# EasyEDA Pro project USB接收端.epro

# Schematic USB接收端
Board Name: USB接收端; Create Date: 2025-04-09; Page Name: P1; Project Name: 空中鼠标; Schematic Name: USB接收端; Update Date: 2025-04-11; Company: 嘉立创EDA; Page Size: A4; Version: V1.0
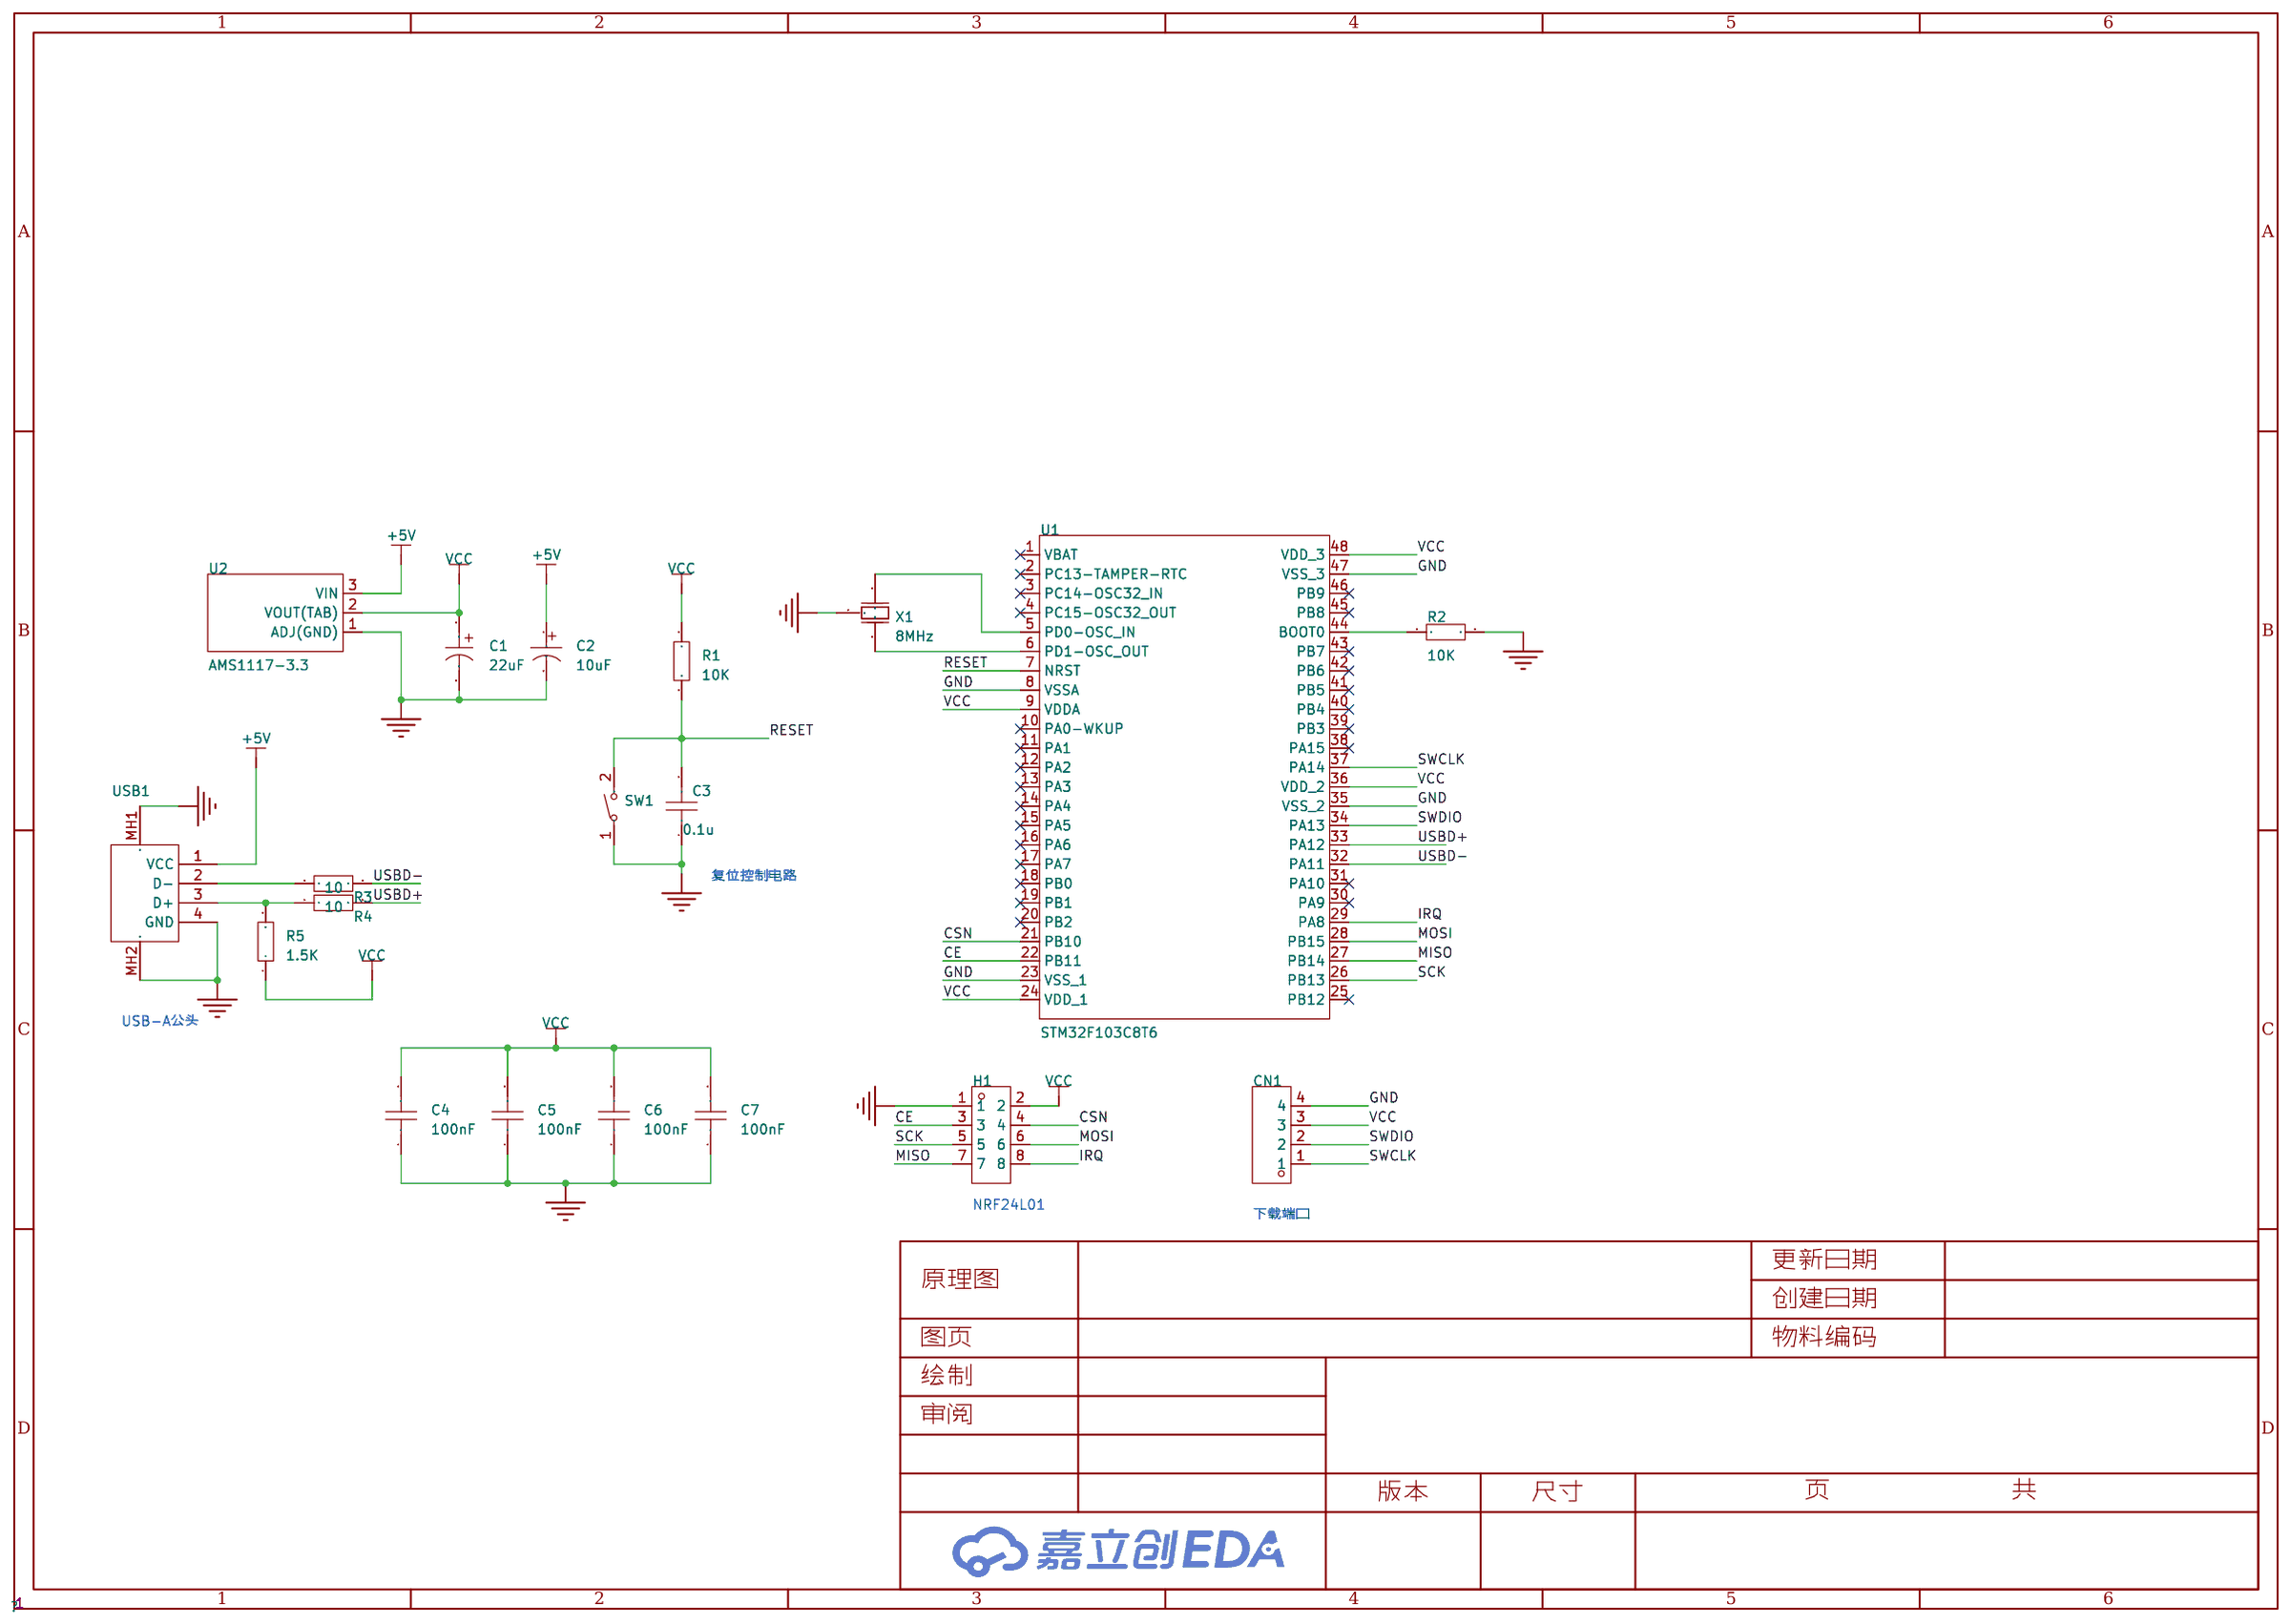
[diagram p0: schematic sheet]

## Parts
C1  22uF  [CAP-SMD_BD5.0-L5.3-W5.3-LS6.0-FD]
C2  10uF  [CAP-SMD_BD4.0-L4.3-W4.3-FD]
C3  0.1u  [C0603]
C4  100nF  [C0603]
C5  100nF  [C0603]
C6  100nF  [C0603]
C7  100nF  [C0603]
CN1  HC-ZH1.5-4AW  [CONN-TH_4P-P1.50_HCTL_HC-ZH1.5-4AW]
H1  PM254V-12-08-H85  [HDR-TH_8P-P2.54-V-F-R2-C4-S2.54]
R1  10K  [R0603]
R2  10K  [R0603]
R3  10  [R0603]
R4  10  [R0603]
R5  1.5K  [R0603]
SW1  GT-TC060A-H025-L1S  [SW-SMD_L6.1-W3.5-LS8.0]
U1  STM32F103C8T6  [LQFP-48_L7.0-W7.0-P0.50-LS9.0-BL]
U2  AMS1117-3.3  [SOT-89_L4.5-W2.5-P1.50-LS4.2-BR]
USB1  AM90  [USB-AM-TH_AM90]
X1  8MHz  [OSC-SMD_3P-L3.2-W1.3-P1.2-L]

## Library data of the parts
C1 = CS1E220M-CRD54_C3001207: 容值:22uF;精度:±20%;额定电压:25V;纹波电流:25mA@120Hz;; LCSC Part Name: 22uF ±20% 25V; Supplier Part: C3001207; Manufacturer: ROQANG(容强); Manufacturer Part: CS1E220M-CRD54; Supplier Footprint: SMD,D5xL5.4mm; JLCPCB Part Class: 扩展库; Datasheet: https://atta.szlcsc.com/upload/public/pdf/source/20220429/2E3FD7691B47DB548ED5C60C43423355.pdf; Supplier: LCSC; Tolerance: ±20%; Voltage Rating: 25V; Ripple Current: 25mA@120Hz; Diameter: 5mm; Height - Seated (Max): 5.4mm; Lifetime: 2000hrs@105℃; Operating Temperature: -40℃~+105℃
C2 = RVT1V100M0405_C72485: 容值:10uF;精度:±20%;额定电压:35V;纹波电流:15mA@120Hz;等效串联电阻(ESR):-;; LCSC Part Name: 10uF ±20% 35V; Supplier Part: C72485; Manufacturer: ROQANG(容强); Manufacturer Part: RVT1V100M0405; Supplier Footprint: SMD,D4xL5.4mm; JLCPCB Part Class: 扩展库; Datasheet: https://atta.szlcsc.com/upload/public/pdf/source/20170325/1490427950282.pdf; Supplier: LCSC; Tolerance: ±20%; Voltage Rating: 35V; Ripple Current: 15mA@120Hz; Diameter: 4mm; Height - Seated (Max): 5.4mm; Lifetime: 2000hrs@105℃; Operating Temperature: -40℃~+105℃
C3-C7 = CAP_0603: Supplier Footprint: 0603
CN1 = HC-ZH1.5-4AW: 插针结构:1x4P;间距:1.5mm;安装方式:弯插;参考系列:ZH;总PIN数:4P;排数:1;每排PIN数:4;行距:-;额定电流:1A;触头材质:黄铜;触头镀层:锡;工作温度范围:-25℃~+85℃;; LCSC Part Name: 1x4P 间距:1.5mm 弯插 系列:ZH; Supplier Part: C2845567; Manufacturer: HCTL(华灿天禄); Supplier Footprint: 弯插,P=1.5mm; JLCPCB Part Class: 扩展库; Datasheet: https://atta.szlcsc.com/upload/public/pdf/source/20230711/CEA84C90BC30863458C9BDB0466F53F6.pdf; Supplier: LCSC; Pins Structure: 1x4P; Pitch: 1.5mm; Mounting Style: 弯插; Reference Series: ZH; Number of Pins: 4P; Number of Rows: 1; Number of PINs Per Row: 4; Current Rating (Max): 1A; Contact Material: 黄铜; Contact Plating: 锡; Operating Temperature Range: -25℃~+85℃; Rated Voltage (Max): 100V; Plastic Material: PBT; Flame Retardant Rating: UL94V-0; Supplementary Features: 打K脚; Z-Height of the Board: 3.7mm; X-Length of Bottom Edge on Board (Spacing Line): 7.5mm
H1 = PM254V-12-08-H85: 插孔结构:2x4P;间距:2.54mm;行距:2.54mm;圆孔/方孔:方孔;安装类型:直插;排数:双排;总孔位数:8P;额定电流:3A;额定电压:250V;插孔方向:顶部;塑高:8.5mm;工作温度范围:-40℃~+105℃;; LCSC Part Name: 间距:2.54mm 2x4P 直插; Supplier Part: C2834799; Manufacturer: XFCN(兴飞); Supplier Footprint: 插件,P=2.54mm; JLCPCB Part Class: 扩展库; Datasheet: https://atta.szlcsc.com/upload/public/pdf/source/20200309/C492399_8C441E2934FBB604A89B37A68AA45ECF.pdf; Supplier: LCSC; Holes Structure: 2x4P; Pitch: 2.54mm; Row Spacing: 2.54mm; Circular Hole / Square Hole: 方孔; Mounting Type: 直插; Number of Rows: 双排; Number of Holes: 8P; Current Rating (Max): 3A; Voltage Rating (Max): 250V; Holes Direction: 顶部; Insulation Height: 8.5mm; Operating Temperature Range: -40℃~+105℃
R1-R5 = Res_0603: Supplier Footprint: 0603
SW1 = GT-TC060A-H025-L1S: 电路结构:单刀单掷;作用力:1.6N;安装方式:立贴;带支架:不带;触点电流:50mA;额定电压(AC):12V;额定电压(DC):12V;绝缘电阻:100MΩ;带灯:无;机械寿命:10万次;; LCSC Part Name: 3×6×2.5 立贴 无声轻触开关; Supplier Part: C7450623; Manufacturer: G-Switch(品赞); Supplier Footprint: SMD,3x6mm; JLCPCB Part Class: 扩展库; Datasheet: https://atta.szlcsc.com/upload/public/pdf/source/20230712/3FF422A4BEDB42853830040444FDF292.pdf; Supplier: LCSC; Circuit: 单刀单掷; Operating Force: 1.6N; Mounting Style: 立贴; Strike Gundam: 不带; Contact Current: 50mA; Voltage Rating (AC): 12V; Voltage Rating (DC): 12V; Insulation Resistance: 100MΩ; With Lamp: 无; Mechanical Life: 10万次
U1 = STM32F103C8T6: CPU内核:ARM-M3;CPU最大主频:72MHz;应用领域:-;; LCSC Part Name: 主流增强型ARM Cortex-M3 MCU，具有64 KB Flash、72 MHz CPU、电机控制、USB和CAN; Supplier Part: C8734; Manufacturer: ST(意法半导体); Supplier Footprint: LQFP-48(7x7); JLCPCB Part Class: 扩展库; Datasheet: https://atta.szlcsc.com/upload/public/pdf/source/20220812/8363ACEC51AD55ECEB84799464F7CB85.pdf; Supplier: LCSC; CPU Core: ARM-M3; CPU Maximum Speed: 72MHz; Program Storage Size: 64KB; Program Memory Type: FLASH; Number of I/O: 37; ADC (Bit): 12bit; Low Voltage Detection Threshold: 2V~3.6V
U2 = AMS1117-3.3_C347256: 输出类型:固定;工作电压:18V;输出电压:3.3V;输出电流:1A;电源纹波抑制比(PSRR):60dB@(120Hz);输出极性:正极;; LCSC Part Name: 输出:3.3V 电流:1A 耐压:18V; Supplier Part: C347256; Manufacturer: UMW(友台半导体); Supplier Footprint: SOT-89; JLCPCB Part Class: 扩展库; Datasheet: https://atta.szlcsc.com/upload/public/pdf/source/20241218/BAF0263FA2E44BCD8AF41AA4FA04EFAA.pdf; Supplier: LCSC; Output Type: 固定; Voltage - Supply: 18V; Output Voltage: 3.3V; Output Current: 1A; Power Supply Rejection Ratio (PSRR): 60dB@(120Hz); Voltage Dropout: 1.3V@(1A); Features: 过流保护; Output Configuration: 正极; Number of Outputs: 1
USB1 = AM90: 连接器类型:Type-A;标准:USB 2.0;公母:公;安装方式:弯插;触点数量:4P;端口数量:1;额定电流 - 电源:1.5A;工作温度范围:-25℃~+85℃;; LCSC Part Name: Type-A 公 弯插; Supplier Part: C404965; Manufacturer: SHOU HAN(首韩); Supplier Footprint: 插件; JLCPCB Part Class: 扩展库; Datasheet: https://atta.szlcsc.com/upload/public/pdf/source/20190722/C404965_9CC10BE28E3F9E5134758D030387C529.pdf; Supplier: LCSC; Connector Type: Type-A; Standard: USB 2.0; Gender: 公; Mounting Style: 弯插; Number of Contacts: 4P; Number of Ports: 1; Current Rating - Power (Max): 1.5A; Rated Voltage (Max): 30V; Connect-Disconnect Life: 5千次; Length: 18.8mm; Core Colour: 白色; Operating Temperature Range: -25℃~+85℃
X1 = CSTNE8M00G55A000R0: 频率:8MHz;内置负载电容:33pF;谐振阻抗:40Ω;; LCSC Part Name: 8MHz ±0.5% 内置负载电容:33pF; Supplier Part: C341523; Manufacturer: muRata(村田); Supplier Footprint: SMD3213-3P; JLCPCB Part Class: 扩展库; Datasheet: https://atta.szlcsc.com/upload/public/pdf/source/20200825/C341523_950053839A9C6B01BAE4CEAFDE23CC6C.pdf; Supplier: LCSC; Built-in Load Capacitance: 33pF; Resonant Impedance: 40Ω; Operating Temperature: -40℃~+125℃

## Nets
+5V: C2.1 U2.3(VIN) USB1.1(VCC)
GND: C1.2 C2.2 C3.1 C4.1 C5.1 C6.1 C7.1 CN1.4 H1.1 R2.2 SW1.1 U1.8(VSSA) U1.23(VSS_1) U1.35(VSS_2) U1.47(VSS_3) U2.1(ADJ(GND)) USB1.4(GND) USB1.MH1 USB1.MH2 X1.2(GND)
VCC: C1.1 C4.2 C5.2 C6.2 C7.2 CN1.3 H1.2 R1.1 R5.1 U1.9(VDDA) U1.24(VDD_1) U1.36(VDD_2) U1.48(VDD_3) U2.2(VOUT(TAB))
CE: H1.3 U1.22(PB11)
CSN: H1.4 U1.21(PB10)
IRQ: H1.8 U1.29(PA8)
MISO: H1.7 U1.27(PB14)
MOSI: H1.6 U1.28(PB15)
RESET: C3.2 R1.2 SW1.2 U1.7(NRST)
SCK: H1.5 U1.26(PB13)
SWCLK: CN1.1 U1.37(PA14)
SWDIO: CN1.2 U1.34(PA13)
USBD+: R4.2 U1.33(PA12)
USBD-: R3.2 U1.32(PA11)
$1N1567: R4.1 R5.2 USB1.3(D+)
$1N2710: R2.1 U1.44(BOOT0)
$1N2781: U1.6(PD1-OSC_OUT) X1.1(OSC1)
$1N2790: U1.5(PD0-OSC_IN) X1.3(OSC2)
$1N2959: R3.1 USB1.2(D-)

Not connected (* = marked no-connect by the designer): U1 1(VBAT)* 2(PC13-TAMPER-RTC)* 3(PC14-OSC32_IN)* 4(PC15-OSC32_OUT)* 10(PA0-WKUP)* 11(PA1)* 12(PA2)* 13(PA3)* 14(PA4)* 15(PA5)* 16(PA6)* 17(PA7)* 18(PB0)* 19(PB1)* 20(PB2)* 25(PB12)* 30(PA9)* 31(PA10)* 38(PA15)* 39(PB3)* 40(PB4)* 41(PB5)* 42(PB6)* 43(PB7)* 45(PB8)* 46(PB9)*

## Notes on the sheet
- 复位控制电路
- USB-A公头
- NRF24L01
- 下载端口

# Board PCB1
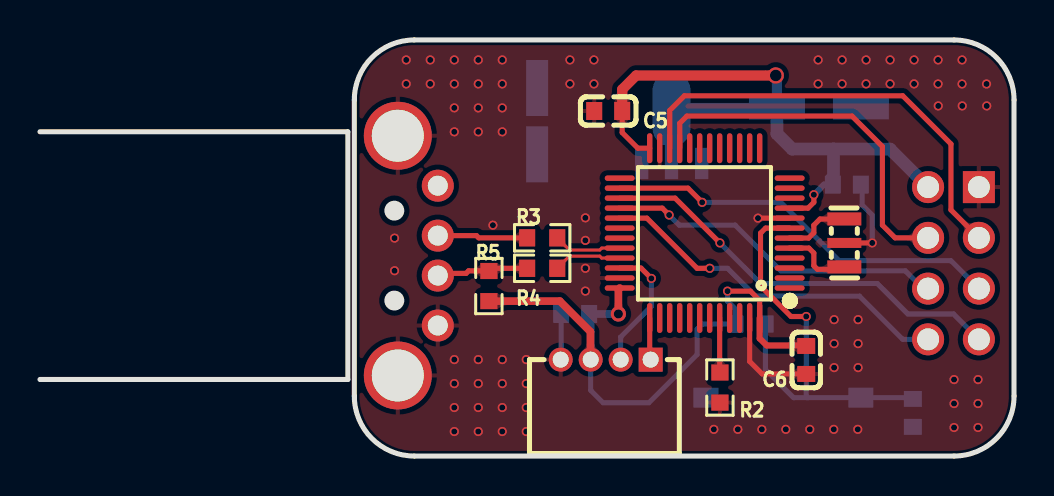
[diagram p1: board, top side]
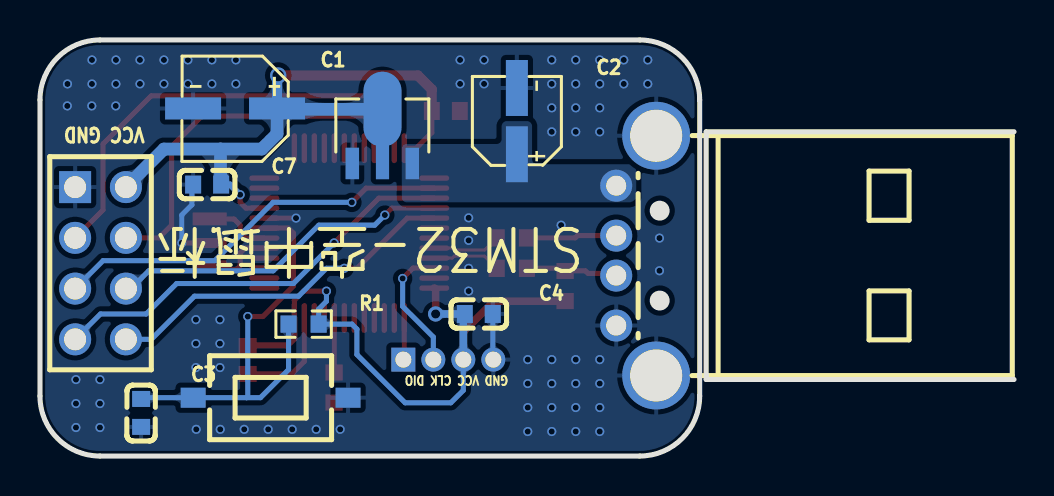
[diagram p2: board, bottom side, seen from below]

Outline 48.72 x 20.83 mm; copper layers: Top Layer, Inner1, Inner2, Bottom Layer. Coordinates in mm from the lower left corner of the outline.
Outline path: 15.72,17.83 15.72,3 arc(16.6,0.88) 18.72,0 45.72,0 arc(47.85,0.88) 48.72,3 48.72,17.83 arc(47.85,19.95) 45.72,20.83 18.72,20.83 arc(16.6,19.95) 15.72,17.83
Stack: Top Layer 0.035mm 外层铜厚1oz / Dielectric1 0.2104mm 7628 RC49% 8.6mil / Inner1 0.0152mm 内层铜厚 / Dielectric2 1.065mm 1.1mm H/HOZ Copper / Inner2 0.0152mm 内层铜厚 / Dielectric3 0.2104mm 7628 RC49% 8.6mil / Bottom Layer 0.035mm 外层铜厚1oz

## Design rules (mm)
net USBD-: DP1
net USBD+: DP1
template: 自定义配置
spacing copperThickness1oz (default): track to track 0.152, other pairs 0.152 to 0.3
spacing copperThickness2oz: track to track 0.203, other pairs 0.152 to 0.3
track width copperThickness1oz (default): min 0.127, default 0.254, max 2.54
track width copperThickness2oz: min 0.203, default 0.254, max 2.54
differential pair differentialPair (default): width min 0.152, default 0.152, max 0.152; gap min 0.152, default 0.152
via viaSize (default): diameter min 0.305, default 0.457, max 10; hole min 0.3, default 0.305, max 6.299
net +5V uses copperRegion1

## Placement (name value [footprint] x y rotation side)
C1  22uF  [CAP-SMD_BD5.0-L5.3-W5.3-LS6.0-FD]  38.97 17.4 0 bottom
C2  10uF  [CAP-SMD_BD4.0-L4.3-W4.3-FD]  24.87 16.76 90 bottom
C3  0.1u  [C0603]  43.66 2.16 90 bottom
C4  100nF  [C0603]  26.77 7.11 0 bottom
C5  100nF  [C0603]  28.42 17.27 0 top
C6  100nF  [C0603]  38.33 4.81 90 top
C7  100nF  [C0603]  40.36 13.59 180 bottom
CN1  HC-ZH1.5-4AW  [CONN-TH_4P-P1.50_HCTL_HC-ZH1.5-4AW]  28.3 4.83 0 top
H1  PM254V-12-08-H85  [HDR-TH_8P-P2.54-V-F-R2-C4-S2.54]  45.7 9.65 270 bottom
R1  10K  [R0603]  35.54 6.6 0 bottom
R2  10K  [R0603]  34.01 3.43 270 top
R3  10  [R0603]  25.12 10.92 0 top
R4  10  [R0603]  25.12 9.4 0 top
R5  1.5K  [R0603]  22.46 8.51 90 top
SW1  GT-TC060A-H025-L1S  [SW-SMD_L6.1-W3.5-LS8.0]  37.19 2.92 0 bottom
U1  STM32F103C8T6  [LQFP-48_L7.0-W7.0-P0.50-LS9.0-BL]  33.25 11.16 90 top
U2  AMS1117-3.3  [SOT-89_L4.5-W2.5-P1.50-LS4.2-BR]  31.6 16 270 bottom
USB1  AM90  [USB-AM-TH_AM90]  18.9 10.03 90 bottom
X1  8MHz  [OSC-SMD_3P-L3.2-W1.3-P1.2-L]  40.24 10.67 270 top

## Footprints (pads in the part's own frame, mm; a bottom-side part is the same pattern mirrored in y, then rotated)
C0603
  rect 0.8x0.9 smd: 1(-0.7,0) 2(0.7,0)
CAP-SMD_BD4.0-L4.3-W4.3-FD
  rect 2.8x1.1 smd: 1(-1.661,0) 2(1.661,0)
CAP-SMD_BD5.0-L5.3-W5.3-LS6.0-FD
  rect 2.8x1.1 smd: 1(-2.1,0) 2(2.1,0)
CONN-TH_4P-P1.50_HCTL_HC-ZH1.5-4AW
  rect 1.2x1.2 hole 0.8: 1(2.25,0)
  round 1.2 hole 0.8: 2(0.75,0) 3(-0.75,0) 4(-2.25,0)
HDR-TH_8P-P2.54-V-F-R2-C4-S2.54
  rect 1.6x1.6 hole 1.1: 1(-3.81,-1.27)
  round 1.6 hole 1.1: 2(-3.81,1.27) 3(-1.27,-1.27) 4(-1.27,1.27) 5(1.27,-1.27) 6(1.27,1.27) 7(3.81,-1.27) 8(3.81,1.27)
LQFP-48_L7.0-W7.0-P0.50-LS9.0-BL
  oval 0.27x1.5 smd: 1(-2.75,-4.25) 2(-2.25,-4.25) 3(-1.75,-4.25) 4(-1.25,-4.25) 5(-0.75,-4.25) 6(-0.25,-4.25) 7(0.25,-4.25) 8(0.75,-4.25) 9(1.25,-4.25) 10(1.75,-4.25) 11(2.25,-4.25) 12(2.75,-4.25) 25(2.75,4.25) 26(2.25,4.25) 27(1.75,4.25) 28(1.25,4.25) 29(0.75,4.25) 30(0.25,4.25) 31(-0.25,4.25) 32(-0.75,4.25) 33(-1.25,4.25) 34(-1.75,4.25) 35(-2.25,4.25) 36(-2.75,4.25)
  oval 1.5x0.27 smd: 13(4.25,-2.75) 14(4.25,-2.25) 15(4.25,-1.75) 16(4.25,-1.25) 17(4.25,-0.75) 18(4.25,-0.25) 19(4.25,0.25) 20(4.25,0.75) 21(4.25,1.25) 22(4.25,1.75) 23(4.25,2.25) 24(4.25,2.75) 37(-4.25,2.75) 38(-4.25,2.25) 39(-4.25,1.75) 40(-4.25,1.25) 41(-4.25,0.75) 42(-4.25,0.25) 43(-4.25,-0.25) 44(-4.25,-0.75) 45(-4.25,-1.25) 46(-4.25,-1.75) 47(-4.25,-2.25) 48(-4.25,-2.75)
OSC-SMD_3P-L3.2-W1.3-P1.2-L
  rect 0.65x1.7 smd: 1(-1.2,0) 3(1.2,0)
  rect 0.5x1.7 smd: 2(0,0)
R0603
  rect 0.806x0.864 smd: 1(-0.753,0) 2(0.753,0)
SOT-89_L4.5-W2.5-P1.50-LS4.2-BR
  rect 1.575x0.672 smd: 1(1.356,-1.5) 3(1.356,1.5)
  custom 5.377x1.9 smd: 2(-1.356,0.009)
SW-SMD_L6.1-W3.5-LS8.0
  rect 1.25x1 smd: 1(-3.875,0) 2(3.875,0)
USB-AM-TH_AM90
  round 1.6 hole 1: 1(3.5,1) 2(1,1) 3(-1,1) 4(-3.5,1)
  round 3.4 hole 2.6: MH1(6,-1) MH2(-6,-1)

## Nets
As in the schematic.

Pads without a net: U1 1 2 3 4 10 11 12 13 14 15 16 17 18 19 20 25 30 31 38 39 40 41 42 43 45 46

## Via types
v1: diameter 0.457, hole 0.305, Top Layer to Bottom Layer, 90 vias
v2: diameter 0.762, hole 0.457, Top Layer to Bottom Layer, 1 via
v3: diameter 0.813, hole 0.584, Top Layer to Bottom Layer, 1 via

## Routing (per net, layer and track width the routed paths; a pad name or vN(x,y) marks a point on that pad's centre or on a via; arc(x,y) is an arc through that point)
GND: length 13.7
  Top Layer w0.254: U1.47 35.5,4.73 36.13,4.11 C6.1 ; X1.2 v1(41.63,10.67) ; U1.8 v1(35.92,11.91)
  Bottom Layer w0.254: 26.07,7.11 26.07,4.85 CN1.4 ; C7.1 41.12,13.53 41.12,12.57 41.63,12.06 v1(41.63,10.67)
  vias: v1(17.74,10.91) v1(17.74,9.28) v1(18.32,19.83) v1(18.32,18.63) v1(19.52,19.83) v1(19.52,18.63) v1(20.72,19.83) v1(20.72,18.63) v1(20.72,17.43) v1(20.72,16.23) v1(20.72,4.83) v1(20.72,3.63) v1(20.72,2.43) v1(20.72,1.23) v1(21.92,19.83) v1(21.92,18.63) v1(21.92,17.43) v1(21.92,16.23) v1(21.92,4.83) v1(21.92,3.63) v1(21.92,2.43) v1(21.92,1.23) v1(22.66,11.56) v1(23.12,19.83) v1(23.12,18.63) v1(23.12,17.43) v1(23.12,16.23) v1(23.12,4.83) v1(23.12,3.63) v1(23.12,2.43) v1(23.12,1.23) v1(24.32,4.83) v1(24.32,3.63) v1(24.32,2.43) v1(24.32,1.23) v1(26.51,19.83) v1(26.51,18.63) v1(27.28,11.92) v1(27.28,10.8) v1(27.28,9.4) v1(27.28,8.26) v1(27.71,19.83) v1(27.71,18.63) v1(33.71,1.34) v1(34.91,1.34) v1(36.11,1.34) v1(37.31,1.34) v1(38.51,1.34) v1(38.92,19.83) v1(38.92,18.63) v1(39.72,6.83) v1(39.72,5.63) v1(39.72,4.43) v1(39.71,1.34) v1(40.12,19.83) v1(40.12,18.63) v1(40.92,6.83) v1(40.92,5.63) v1(40.92,4.43) v1(40.91,1.34) v1(41.32,19.83) v1(41.32,18.63) v1(42.53,19.83) v1(42.53,18.63) v1(43.72,19.83) v1(43.72,18.63) v1(44.92,19.83) v1(44.92,18.62) v1(44.94,17.53) v1(45.72,3.83) v1(45.72,2.63) v1(45.72,1.43) v1(46.12,19.83) v1(46.12,18.62) v1(46.13,17.53) v1(46.92,3.83) v1(46.92,2.63) v1(46.92,1.43) v1(47.35,18.62) v1(47.36,17.53)
VCC: length 65.1
  Top Layer w0.254: v1(38.71,13.08) 38.71,12.7 38.42,12.41 U1.9 ; U1.48 36,7.79 35.54,8.26 v1(34.39,8.26) ; U1.24 29.91,15.41 29.12,16.19 C5.2
  Top Layer w0.305: C6.2 38.31,5.54 36.35,5.54 36,5.89 U1.48
  Top Layer w0.381: CN1.3 27.54,4.84 27.54,6.22 26,7.76 R5.1 ; v2(28.93,7.11) 28.93,8.34 U1.36
  Top Layer w0.508: C5.2 29.12,18.35 29.82,19.05 v3(36.81,19.05)
  Bottom Layer w0.254: CN1.3 27.55,3.29 28.17,2.67 30.46,2.67 32.87,5.08 32.87,6.35 33.12,6.6 R1.1 34.78,7.36 34.39,7.75 v1(34.39,8.26)
  Bottom Layer w0.305: C7.2 39.22,13.59 v1(38.71,13.08)
  Bottom Layer w0.381: CN1.3 27.55,7.04 C4.2 v2(28.93,7.11)
  Bottom Layer w0.508: v3(36.81,19.05) 36.87,18.99 36.87,17.4
  Bottom Layer w0.635: 39.69,15.37 37.63,15.37 36.87,16.13 36.87,17.4 36.83,17.36 U2.2 ; 39.69,15.37 39.69,13.62 ; 39.69,15.37 42.52,15.37 H1.2 ; 39.6,13.9 39.66,13.84
CE: length 22.5
  Top Layer w0.254: U1.22 31.5,17.3 32.23,18.03 43.16,18.03 45.57,15.62 45.57,12.32 H1.3
CSN: length 18.7
  Top Layer w0.254: H1.4 42.78,10.92 42.14,11.56 42.14,15.49 40.62,17.02 32.36,17.02 32,16.66 U1.21
IRQ: length 17.9
  Top Layer w0.254: v1(33.5,9.4) 32.87,9.4 30.36,11.91 U1.29
  Bottom Layer w0.254: v1(33.5,9.4) 34.39,9.4 35.79,8 41,8 43.16,5.84 H1.8
MISO: length 20.9
  Top Layer w0.254: U1.27 31.77,12.91 v1(34.01,10.67)
  Bottom Layer w0.254: H1.7 45.7,7.11 43.41,7.11 41.89,8.64 36.04,8.64 v1(34.01,10.67)
MOSI: length 17.1
  Top Layer w0.254: v1(31.47,12.06) 31.13,12.41 U1.28
  Bottom Layer w0.254: v1(31.47,12.06) 31.98,11.56 34.78,11.56 37.06,9.27 43.28,9.27 44.17,8.38 H1.6
RESET: length 21.5
  Top Layer w0.254: v1(38.33,6.98) 37.57,6.98 36.04,8.51 36.04,11.16 36.3,11.41 U1.7
  Bottom Layer w0.254: 38.39,2.92 38.33,2.98 v1(38.33,6.98) ; 38.39,2.92 37.7,2.92 36.29,4.33 R1.2 ; 38.39,2.92 SW1.2 43.6,2.92 C3.2
SCK: length 20
  Top Layer w0.254: v1(33.12,12.7) 32.41,13.41 U1.26
  Bottom Layer w0.254: H1.5 45.57,9.78 39.98,9.78 37.06,12.7 v1(33.12,12.7)
SWCLK: length 2.1
  Top Layer w0.254: U1.37 30.5,4.87 CN1.1
SWDIO: length 6.5
  Top Layer w0.254: U1.34 30.06,9.41 v1(30.58,8.89)
  Bottom Layer w0.254: v1(30.58,8.89) 30.58,7.49 29.05,5.96 CN1.2
USBD+: length 3.4
  Top Layer w0.152: R4.2 26.49,10.01 28,10.01 28.1,9.91 U1.33
USBD-: length 3.4
  Top Layer w0.152: R3.2 26.49,10.31 28,10.31 28.1,10.41 U1.32
$1N1567: length 4.8
  Top Layer w0.254: 19.77,9.03 20.47,9.03 20.58,9.14 21.31,9.14 21.44,9.27 22.45,9.27 R5.2 22.59,9.4 R4.1
$1N2710: length 2.7
  Top Layer w0.254: U1.44 34,4.19 R2.1
$1N2781: length 3.4
  Top Layer w0.254: U1.6 38.45,10.91 38.71,11.18 38.71,11.56 39.02,11.86 40.23,11.86 X1.1
$1N2790: length 3.6
  Top Layer w0.254: X1.3 40.11,9.35 38.89,9.35 38.71,9.53 38.71,10.16 38.46,10.41 U1.5
$1N2959: length 4.6
  Top Layer w0.254: R3.1 21.95,10.92 21.84,11.03 19.77,11.03

## Copper pours and planes (outline as drawn; the poured copper is in the pictures)
+5V on Bottom Layer: 18.9,14.35 19.05,14.54 19.28,14.61 23.85,14.61 24.03,14.68 24.11,14.86 24.11,16.51 24.18,16.69 24.36,16.76 25.38,16.76 25.56,16.69 25.63,16.51 25.63,15.88 25.71,15.7 25.88,15.62 30.37,15.62 30.55,15.55 30.63,15.37 30.63,12.95 30.55,12.77 30.37,12.7 19.28,12.7 19.05,12.77 18.9,12.95
GND on Top Layer: 13.44,23.5 51.79,23.5 51.79,-2.16 13.44,-2.16
GND on Bottom Layer: 11.15,22.61 51.03,22.61 51.03,-0.89 11.15,-0.89
GND on Inner1: 15.98,20.57 48.47,20.57 48.47,0.26 15.98,0.26
VCC on Inner2: 15.98,20.57 48.47,20.57 48.47,0.26 15.98,0.26

Small or netless copper shapes (teardrops, artwork), in the pictures only: 23 on Top Layer, 28 on Bottom Layer, 17 on Inner1, 6 on Inner2

## Text on the board
Bottom Silkscreen Layer: GND VCC CLK DIO | VCC GND | STM32-空中鼠标
